# Altium schematic sheet PowerAmplifier.SchDoc
size A4; SheetNumber: 5; SheetTotal: 5
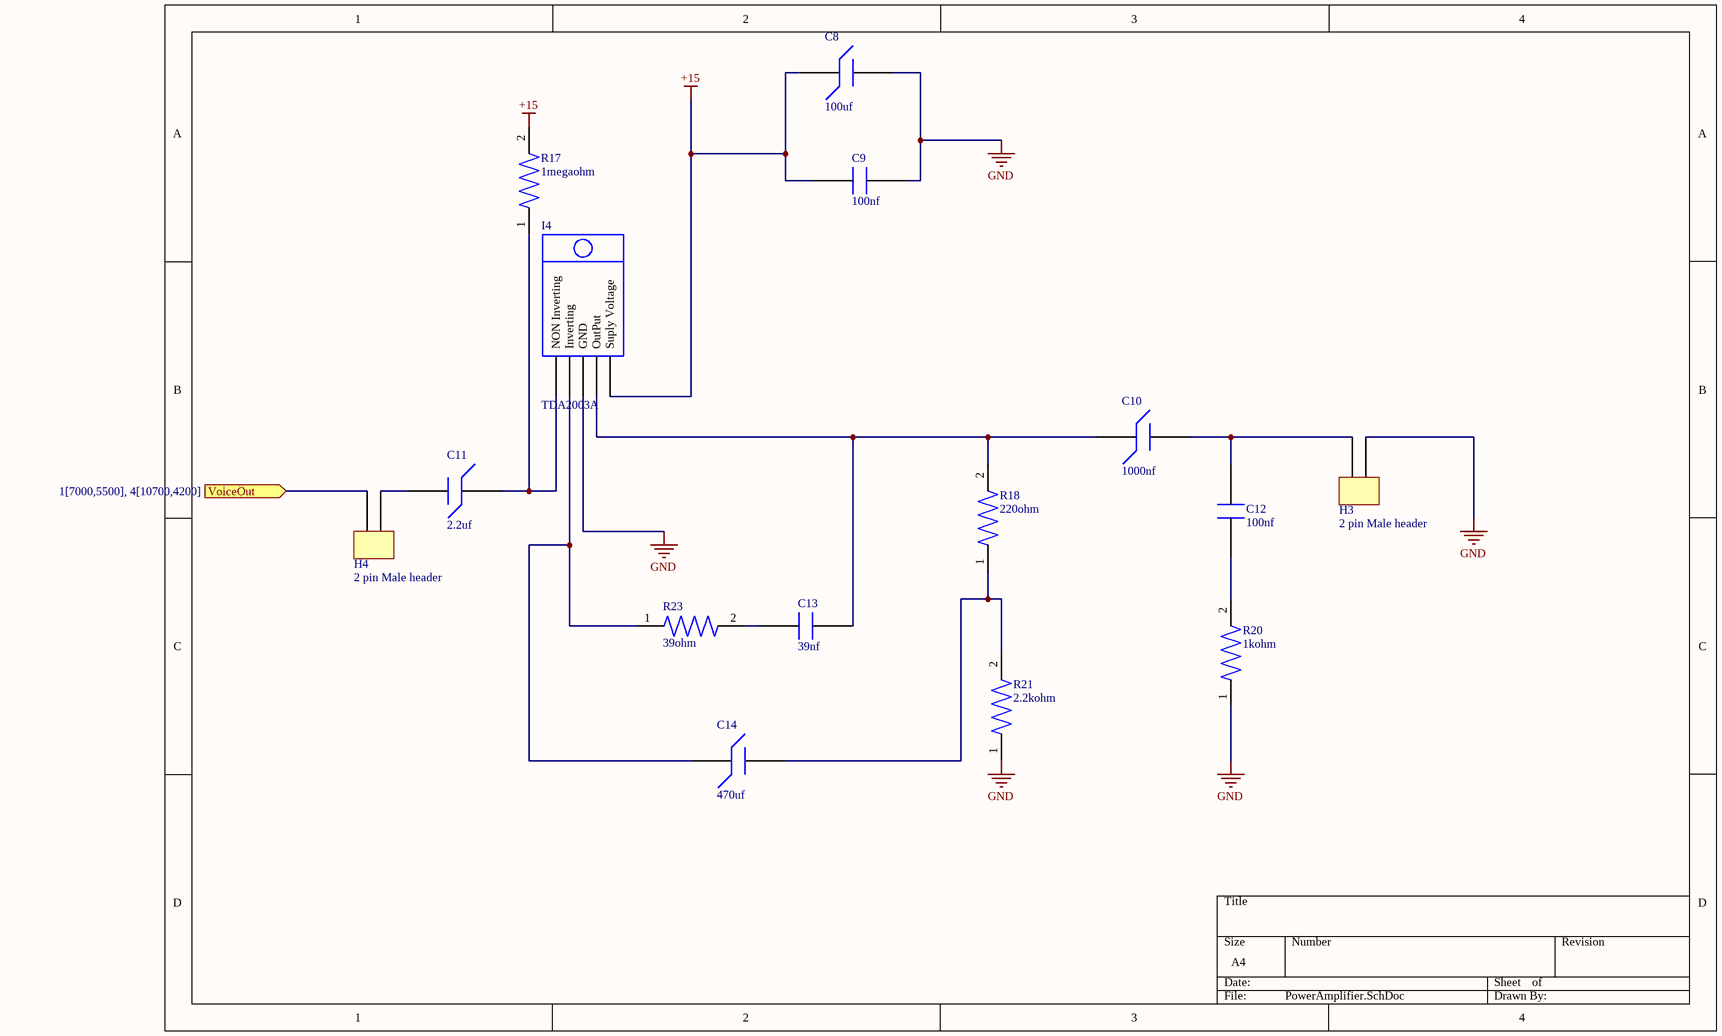
[diagram p0: PowerAmplifier.SchDoc]

## Parts
C8  100uf  [Capasitor]
C9  100nf  [ceramic Capacitor]
C10  1000nf  [Capasitor]
C11  2.2uf  [Capasitor]
C12  100nf  [ceramic Capacitor]
C13  39nf  [Ceramic Capacitor 2]
C14  470uf  [Capasitor]
H3  2 pin Male header  [2pin Male Heder]
H4  2 pin Male header  [2pin Male Heder]
I4  TDA2003A  [TDA2003AV]
R17  1megaohm  [Resistor]
R18  220ohm  [Resistor]
R20  1kohm  [Resistor]
R21  2.2kohm  [Resistor]
R23  39ohm  [Resistor]

## Ports
VoiceOut (in, see 1[7000,5500], 4[10700,4200])

## Nets
+15: C8.2 C9.1 I4.5(Suply_Voltage) R17.2
GND: C8.1 C9.2 H3.1 I4.3(GND) R20.1 R21.1
VoiceOut: H4.2 ; port VoiceOut
NetC10_1: C10.1 C12.2 H3.2
NetC10_2: C10.2 C13.2 I4.4(OutPut) R18.2
NetC11_1: C11.1 H4.1
NetC11_2: C11.2 I4.1(NON_Inverting) R17.1
NetC12_1: C12.1 R20.2
NetC13_1: C13.1 R23.2
NetC14_1: C14.1 R18.1 R21.2
NetC14_2: C14.2 I4.2(Inverting) R23.1

## Library data of the parts
C8 = 35ZLH100MEFC6.3X11: Aluminum Electrolytic Capacitor, Polarized, Aluminum (wet), 35V, 20% +Tol, 20% -Tol, 100uF, Through Hole Mount; Manufacturer: Rubycon; Manufacturer Series: ZLH; Dielectric Material: Aluminium; Ripple Current: 540mA; Supplier: Digikey; Supplier Part Number: 1189-1300-ND; Manufacturer Part Number: 35ZLH100MEFC6.3X11; RoHS: Yes; Category: Aluminum Electrolytic Capacitors; Stock: 13897; Pricing: 1=0.31, 10=0.187, 50=0.1362, 100=0.1201, 500=0.09204, 2000=0.07579, 4000=0.06965, 6000=0.06655 (USD); Pins: 2; Min Operating Temperature: -40°C; Max Operating Temperature: 105°C; Polarity: Polarized; Value: 100uF; Capacitor Type: Aluminium; Tolerance  (fill in as +-): 20%; Package Style: RadialMeter; Packaging: Bulk; Tolerance (fill in as +-): 20%; Rated DC Voltage (URdc): 35V; Diameter: 6.3mm; Length: 11mm; Terminal Pitch: 2.5mm; Reach SVHC Compliant: Yes; RoHS Compliant: Yes; ComponentLink1URL: https://datasheet.ciiva.com:443/pdfs/VipMasterIC/IC/RUBY/RUBYS01453/RUBYS01453-1.pdf?src-supplier=IHS+Markit; ComponentLink1Description: https://datasheet.ciiva.com:443/pdfs/VipMasterIC/IC/RUBY/RUBYS01453/RUBYS01453-1.pdf?src-supplier=IHS+Markit; ComponentLink2URL: https://datasheet.ciiva.com/11782/0900766b80e2f602-11782304.pdf?src-supplier=Rs; ComponentLink2Description: https://datasheet.ciiva.com/11782/0900766b80e2f602-11782304.pdf?src-supplier=Rs; ComponentLink3URL: https://datasheet.ciiva.com/11690/e-zlh-11690956.pdf?src-supplier=Avnet; ComponentLink3Description: https://datasheet.ciiva.com/11690/e-zlh-11690956.pdf?src-supplier=Avnet; ComponentLink4URL: https://datasheet.ciiva.com/1456/e-zlh-1456215.pdf?src-supplier=Element14; ComponentLink4Description: https://datasheet.ciiva.com/1456/e-zlh-1456215.pdf?src-supplier=Element14; ComponentLink5URL: https://datasheet.ciiva.com/5713/e-zlh-5713612.pdf?src-supplier=Farnell; ComponentLink5Description: https://datasheet.ciiva.com/5713/e-zlh-5713612.pdf?src-supplier=Farnell; ComponentLink6URL: https://datasheet.ciiva.com/6311/e-zlh-6311224.pdf?src-supplier=Digikey; ComponentLink6Description: https://datasheet.ciiva.com/6311/e-zlh-6311224.pdf?src-supplier=Digikey
C9 C12 = K104K20X7RK53H5G: Manufacturer: Vishay BCcomponents; Supplier: Digikey; Supplier Part Number: 56-K104K20X7RK53H5G-ND; Manufacturer Part Number: K104K20X7RK53H5G; RoHS: No; Category: Ceramic Capacitors; Stock: 17432; Pricing: 1=0.87, 10=0.559, 100=0.4058, 1000=0.31705, 3000=0.29613 (USD)
C10 = 10ZLH1000MEFC10X12.5: Aluminum Electrolytic Capacitor, Polarized, Aluminum (wet), 10V, 20% +Tol, 20% -Tol, 1000uF, Through Hole Mount; Manufacturer: Rubycon; Dielectric Material: Aluminium; Value: 1mF; Ripple Current: 1.33A; Supplier: Digikey; Supplier Part Number: 1189-1072-ND; Manufacturer Part Number: 10ZLH1000MEFC10X12.5; RoHS: Yes; Category: Aluminum Electrolytic Capacitors; Stock: 171118; Pricing: 1=0.51, 10=0.318, 50=0.2356, 100=0.2095, 500=0.16416, 1000=0.14984, 3000=0.13193, 5000=0.12524 (USD); Pins: 2; Min Operating Temperature: -40°C; Max Operating Temperature: 105°C; Polarity: Polarized; Capacitor Type: Aluminium; Tolerance  (fill in as +-): 20%; Package Style: RadialMeter; Packaging: Bulk; Tolerance (fill in as +-): 20%; Rated DC Voltage (URdc): 10V; Diameter: 10mm; Length: 12.5mm; Terminal Pitch: 5mm; Reach SVHC Compliant: Yes; RoHS Compliant: Yes; ComponentLink1URL: https://datasheet.ciiva.com:443/pdfs/VipMasterIC/IC/RUBY/RUBYS01453/RUBYS01453-1.pdf?src-supplier=IHS+Markit; ComponentLink1Description: https://datasheet.ciiva.com:443/pdfs/VipMasterIC/IC/RUBY/RUBYS01453/RUBYS01453-1.pdf?src-supplier=IHS+Markit; ComponentLink2URL: https://datasheet.ciiva.com/11779/0900766b80e2f602-11779591.pdf?src-supplier=Rs; ComponentLink2Description: https://datasheet.ciiva.com/11779/0900766b80e2f602-11779591.pdf?src-supplier=Rs; ComponentLink3URL: https://datasheet.ciiva.com/6316/e-zlh-6316685.pdf?src-supplier=Digikey; ComponentLink3Description: https://datasheet.ciiva.com/6316/e-zlh-6316685.pdf?src-supplier=Digikey; ComponentLink4URL: https://datasheet.ciiva.com/11690/e-zlh-11690747.pdf?src-supplier=Avnet; ComponentLink4Description: https://datasheet.ciiva.com/11690/e-zlh-11690747.pdf?src-supplier=Avnet; ComponentLink5URL: https://datasheet.ciiva.com/22732/1910927-22732378.pdf?src-supplier=Element14; ComponentLink5Description: https://datasheet.ciiva.com/22732/1910927-22732378.pdf?src-supplier=Element14
C11 = 400LLE2R2MEFC8X11.5: Aluminum Electrolytic Capacitor, Polarized, Aluminum (wet), 400V, 20% +Tol, 20% -Tol, 2.2uF, Through Hole Mount; Manufacturer: Rubycon; Supplier: Digikey; Supplier Part Number: 1189-1329-ND; Manufacturer Part Number: 400LLE2R2MEFC8X11.5; RoHS: Yes; Category: Aluminum Electrolytic Capacitors; Stock: 36469; Pricing: 1=0.53, 10=0.326, 50=0.2416, 100=0.2148, 500=0.16848, 2000=0.14171, 4000=0.1316, 6000=0.1265 (USD); ComponentLink1URL: https://datasheet.ciiva.com:443/pdfs/VipMasterIC/IC/RUBY/RUBYS01654/RUBYS01654-1.pdf?src-supplier=IHS+Markit; ComponentLink1Description: https://datasheet.ciiva.com:443/pdfs/VipMasterIC/IC/RUBY/RUBYS01654/RUBYS01654-1.pdf?src-supplier=IHS+Markit; ComponentLink2URL: https://datasheet.ciiva.com/29544/e-lle-29544381.pdf?src-supplier=Digikey; ComponentLink2Description: https://datasheet.ciiva.com/29544/e-lle-29544381.pdf?src-supplier=Digikey
C13 = C320C393K3G5TA: Manufacturer: KEMET; Supplier: Digikey; Supplier Part Number: C320C393K3G5TA-ND; Manufacturer Part Number: C320C393K3G5TA; RoHS: No; Category: Ceramic Capacitors; Pricing: 1500=0.15707 (USD)
C14 = 16ZLJ470MTA8X11.5: Aluminum Electrolytic Capacitor, Polarized, Aluminum (wet), 16V, 20% +Tol, 20% -Tol, 470uF; Manufacturer: Rubycon; Dielectric Material: Aluminium; Ripple Current: 1.2A; Supplier: Digikey; Supplier Part Number: 1189-1549-1-ND; Manufacturer Part Number: 16ZLJ470MTA8X11.5; RoHS: Yes; Category: Aluminum Electrolytic Capacitors; Stock: 34781; Pricing: 1=0.49, 10=0.305, 50=0.2254, 100=0.2001, 500=0.15654 (USD); Pins: 2; Min Operating Temperature: -40°C; Max Operating Temperature: 105°C; Polarity: Polarized; Value: 470uF; Capacitor Type: Aluminium; Tolerance  (fill in as +-): 20%; Package Style: RadialMeter; Packaging: Tape and Reel; Tolerance (fill in as +-): 20%; Rated DC Voltage (URdc): 16V; Diameter: 8mm; Length: 11.5mm; Terminal Pitch: 5mm; Reach SVHC Compliant: Yes; RoHS Compliant: Yes; ComponentLink1URL: https://datasheet.ciiva.com:443/pdfs/VipMasterIC/IC/RUBY/RUBYS01454/RUBYS01454-1.pdf?src-supplier=IHS+Markit; ComponentLink1Description: https://datasheet.ciiva.com:443/pdfs/VipMasterIC/IC/RUBY/RUBYS01454/RUBYS01454-1.pdf?src-supplier=IHS+Markit; ComponentLink2URL: https://datasheet.ciiva.com/22732/1725816-22732487.pdf?src-supplier=Element14; ComponentLink2Description: https://datasheet.ciiva.com/22732/1725816-22732487.pdf?src-supplier=Element14; ComponentLink3URL: https://datasheet.ciiva.com/6300/e-zlj-6300999.pdf?src-supplier=Digikey; ComponentLink3Description: https://datasheet.ciiva.com/6300/e-zlj-6300999.pdf?src-supplier=Digikey; ComponentLink4URL: https://datasheet.ciiva.com/6301/e-zlj-6301065.pdf?src-supplier=Digikey; ComponentLink4Description: https://datasheet.ciiva.com/6301/e-zlj-6301065.pdf?src-supplier=Digikey
H3 H4 = 61300211121: Board Connector, 2 Contact(s), 1 Row(s), Male, Straight, 0.1 inch Pitch, Solder Terminal, Locking, Black Insulator, Plug; Manufacturer: Wurth Electronics; Option: General Purpose; Contact Pattern: RECTANGULAR; Contact Resistance: 20mR; Contact Style: SQ PIN-SKT; Dielectric Withstanding Voltage (AC): 500V; Filter Feature: No; Insulation Resistance: 1GR; Number Of Connectors: 1; Rated Current (Signal): 3A; Number of Contacts: 2; Body Length: 0.2inch; Reference Standard: UL; Reliability: COMMERCIAL; Supplier: Digikey; Supplier Part Number: 732-5315-ND; Manufacturer Part Number: 61300211121; RoHS: Yes; Category: Headers and Wire Housings; Stock: 123899; Pricing: 1=0.12, 10=0.102, 25=0.0848, 50=0.0712, 100=0.0639, 1000=0.06 (USD); Mounting Technology: Board; Contact Material: Copper Alloy; Contact Finish - Mating: GOLD; Contact Finish - Termination: Gold (Au) - with Nickel (Ni) barrier; Insulation Color: Black; Insulation Material: Polybutylene; Min Operating Temperature: -40°C; Max Operating Temperature: 125°C; Connector Type: BOARD CONNECTOR; JESD-609 Code: e4; Body/Shell Style: PLUG; Contact Gender: Male; Mixed Contacts: No; Mounting Style: STRAIGHT; Number of Rows Loaded: 1; PCB Contact Pattern: RECTANGULAR; Termination: Solder; Body Breadth: 0.1inch; Body Depth: 0.1inch; Mating Contact Pitch: 0.1inch; Mounting Option 1: LOCKING; Terminal Length: 0.118inch; Terminal Pitch: 2.54mm; Flammability Rating: UL94 V-0; Reach SVHC Compliant: Yes; RoHS Compliant: Yes; DIN Conformance: No; IEC Conformance: No; MIL Conformance: No; ComponentLink1URL: https://datasheet.ciiva.com:443/pdfs/VipMasterIC/IC/MIDC/MIDCS07676/MIDCS07676-1.pdf?src-supplier=IHS+Markit; ComponentLink1Description: https://datasheet.ciiva.com:443/pdfs/VipMasterIC/IC/MIDC/MIDCS07676/MIDCS07676-1.pdf?src-supplier=IHS+Markit; ComponentLink2URL: https://datasheet.ciiva.com/13619/6130xx11121-48870-13619345.pdf?src-supplier=Mouser; ComponentLink2Description: https://datasheet.ciiva.com/13619/6130xx11121-48870-13619345.pdf?src-supplier=Mouser
I4 = TDA2003AV: Audio Amplifier, 12W, 1 Channel(s), 1 Func, Bipolar; Manufacturer: STMicroelectronics; Bandwidth-Nom: 15MHz; Gain: 40dB; Number of Channels: 1; Power Supplies: 14.4V; Surface Mount: No; Qualification Status: Not Qualified; Supplier: Farnell; Supplier Part Number: 2067880; Manufacturer Part Number: TDA2003AV; RoHS: Yes; Category: Amplifiers - Audio; Pricing: 1=0.94, 10=0.83, 100=0.65, 250=0.57, 500=0.5 (GBP); Case/Package: ZIP; Pins: 5; Package Shape: Rectangular; Terminal Finish: Tin; JESD-609 Code: e3; Consumer IC Type: AUDIO AMPLIFIER; Channels: 1; Output Power-Nom: 12W; Technology: BIPOLAR; Terminal Form: Through Hole; Terminal Position: ZIG-ZAG; Terminal Pitch: 1.7mm; RoHS Compliant: Yes; Reach SVHC Compliant: No; ComponentLink1URL: https://datasheet.ciiva.com:443/pdfs/VipMasterIC/IC/SGST/SGSTS34642/SGSTS34847-1.pdf?src-supplier=IHS+Markit; ComponentLink1Description: https://datasheet.ciiva.com:443/pdfs/VipMasterIC/IC/SGST/SGSTS34642/SGSTS34847-1.pdf?src-supplier=IHS+Markit; ComponentLink2URL: https://datasheet.ciiva.com/4767/dm00028077-100155-4767180.pdf?src-supplier=Mouser; ComponentLink2Description: https://datasheet.ciiva.com/4767/dm00028077-100155-4767180.pdf?src-supplier=Mouser; ComponentLink3URL: https://datasheet.ciiva.com/19463/2183867-19463360.pdf?src-supplier=Jameco; ComponentLink3Description: https://datasheet.ciiva.com/19463/2183867-19463360.pdf?src-supplier=Jameco; ComponentLink4URL: https://datasheet.ciiva.com/15131/getdatasheetpartid-365868-15131921.pdf?src-supplier=Verical; ComponentLink4Description: https://datasheet.ciiva.com/15131/getdatasheetpartid-365868-15131921.pdf?src-supplier=Verical; ComponentLink5URL: https://datasheet.ciiva.com/1481/1690488-1481698.pdf?src-supplier=Element14; ComponentLink5Description: https://datasheet.ciiva.com/1481/1690488-1481698.pdf?src-supplier=Element14; ComponentLink6URL: https://datasheet.ciiva.com/16493/dm00028077-16493721.pdf?src-supplier=Future+Electronics; ComponentLink6Description: https://datasheet.ciiva.com/16493/dm00028077-16493721.pdf?src-supplier=Future+Electronics; ComponentLink7URL: https://datasheet.ciiva.com/1790/dm00028077-1790102.pdf?src-supplier=Digikey; ComponentLink7Description: https://datasheet.ciiva.com/1790/dm00028077-1790102.pdf?src-supplier=Digikey
R17 = CF14JT1M00: Fixed Resistor, Carbon Film, 0.25W, 1000000ohm, 350V, 5% +/-Tol, -1500,0ppm/Cel, Through Hole Mount; Manufacturer: Stackpole Electronics; Power: 250mW; Rated Temperature: 70°C; Value: 1MR; Temperature Coefficient (ppm/Cel): 1500; Lead Diameter: 0.55mm; Lead Length: 28mm; Package Length: 6mm; Supplier: Digikey; Supplier Part Number: CF14JT1M00CT-ND; Manufacturer Part Number: CF14JT1M00; RoHS: Yes; Category: Through-Hole Resistors; Stock: 240510; Pricing: 1=0.1, 10=0.026, 25=0.022, 50=0.0192, 100=0.0169, 250=0.01424, 500=0.0126, 1000=0.0112 (USD); Mounting Technology: Through Hole; Pins: 2; Package Shape: Tubular; Terminal Finish: Tin; Min Operating Temperature: -55°C; Max Operating Temperature: 155°C; Tolerance: 5%; Resistor Type: FIXED RESISTOR; Construction: Tubular; Package Style: AXIAL; Packaging: Tape and Reel; Technology: CARBON FILM; Termination: Wire; Working Voltage: 350V; JESD-609 Code: e3; Reach SVHC Compliant: Yes; RoHS Compliant: Yes; ComponentLink1URL: https://datasheet.ciiva.com:443/pdfs/VipMasterIC/IC/SEIE/SEIE-S-A0009883960/SEIE-S-A0009883960-1.pdf?src-supplier=IHS+Markit; ComponentLink1Description: https://datasheet.ciiva.com:443/pdfs/VipMasterIC/IC/SEIE/SEIE-S-A0009883960/SEIE-S-A0009883960-1.pdf?src-supplier=IHS+Markit; ComponentLink2URL: https://datasheet.ciiva.com/15193/getdatasheetpartid-359898-15193308.pdf?src-supplier=Verical; ComponentLink2Description: https://datasheet.ciiva.com/15193/getdatasheetpartid-359898-15193308.pdf?src-supplier=Verical
R18 = S4-220RF1: RES SMD 220 OHM 1% 2W 4525; Manufacturer: Riedon; Supplier: Digikey; Supplier Part Number: 696-S4-220RF1CT-ND; Manufacturer Part Number: S4-220RF1; RoHS: Yes; Category: Chip SMD Resistors; Stock: 180; Pricing: 1=2.38, 10=1.582, 25=1.3652, 50=1.23, 100=1.1147, 250=0.98852, 500=0.90956 (USD); ComponentLink1URL: https://datasheet.ciiva.com/18599/ssl-18599814.pdf?src-supplier=Digikey; ComponentLink1Description: https://datasheet.ciiva.com/18599/ssl-18599814.pdf?src-supplier=Digikey; ComponentLink2URL: https://datasheet.ciiva.com/18599/ssl-18599815.pdf?src-supplier=Digikey; ComponentLink2Description: https://datasheet.ciiva.com/18599/ssl-18599815.pdf?src-supplier=Digikey; ComponentLink3URL: https://datasheet.ciiva.com/18599/ssl-18599816.pdf?src-supplier=Digikey; ComponentLink3Description: https://datasheet.ciiva.com/18599/ssl-18599816.pdf?src-supplier=Digikey
R20 = CF14JT1K00: Fixed Resistor, Carbon Film, 0.25W, 1000ohm, 350V, 5% +/-Tol, -400,0ppm/Cel, Through Hole Mount; Manufacturer: Stackpole Electronics; Power: 250mW; Rated Temperature: 70°C; Value: 1kR; Temperature Coefficient (ppm/Cel): 400; Lead Diameter: 0.55mm; Lead Length: 28mm; Package Length: 6mm; Supplier: Digikey; Supplier Part Number: CF14JT1K00CT-ND; Manufacturer Part Number: CF14JT1K00; RoHS: Yes; Category: Through-Hole Resistors; Stock: 680385; Pricing: 1=0.1, 10=0.026, 25=0.022, 50=0.0192, 100=0.0169, 250=0.01424, 500=0.0126, 1000=0.0112 (USD); Mounting Technology: Through Hole; Pins: 2; Package Shape: Tubular; Terminal Finish: Tin; Min Operating Temperature: -55°C; Max Operating Temperature: 155°C; Tolerance: 5%; Resistor Type: FIXED RESISTOR; Construction: Tubular; Package Style: AXIAL; Packaging: Tape and Reel; Technology: CARBON FILM; Termination: Wire; Working Voltage: 350V; JESD-609 Code: e3; Reach SVHC Compliant: Yes; RoHS Compliant: Yes; ComponentLink1URL: https://datasheet.ciiva.com:443/pdfs/VipMasterIC/IC/SEIE/SEIE-S-A0009883960/SEIE-S-A0009883960-1.pdf?src-supplier=IHS+Markit; ComponentLink1Description: https://datasheet.ciiva.com:443/pdfs/VipMasterIC/IC/SEIE/SEIE-S-A0009883960/SEIE-S-A0009883960-1.pdf?src-supplier=IHS+Markit; ComponentLink2URL: https://www.seielect.com/catalog/SEI-Packaging.pdf?src-supplier=Digikey; ComponentLink2Description: https://www.seielect.com/catalog/SEI-Packaging.pdf?src-supplier=Digikey; ComponentLink3URL: https://www.seielect.com/Catalog/SEI-CF_CFM.pdf?src-supplier=Digikey; ComponentLink3Description: https://www.seielect.com/Catalog/SEI-CF_CFM.pdf?src-supplier=Digikey; ComponentLink4URL: https://www.seielect.com/catalog/SEI-CF_CFM.pdf?src-supplier=Avnet; ComponentLink4Description: https://www.seielect.com/catalog/SEI-CF_CFM.pdf?src-supplier=Avnet; ComponentLink5URL: http://components.arrow.com/part/dataview/27620077S9848643N1174?src-supplier=Arrow+Electronics; ComponentLink5Description: http://components.arrow.com/part/dataview/27620077S9848643N1174?src-supplier=Arrow+Electronics; ComponentLink6URL: http://www.seielect.com/Catalog/SEI-CF_CFM.pdf?src-supplier=Future+Electronics; ComponentLink6Description: http://www.seielect.com/Catalog/SEI-CF_CFM.pdf?src-supplier=Future+Electronics; ComponentLink7URL: https://datasheet.octopart.com/CF14JT1K00-Stackpole-Electronics-datasheet-8360004.pdf?src-supplier=Future+Electronics; ComponentLink7Description: https://datasheet.octopart.com/CF14JT1K00-Stackpole-Electronics-datasheet-8360004.pdf?src-supplier=Future+Electronics; ComponentLink8URL: https://www.verical.com/server-webapp/html/getDatasheet?partID=360403&src-supplier=Verical; ComponentLink8Description: https://www.verical.com/server-webapp/html/getDatasheet?partID=360403&src-supplier=Verical; ComponentLink9URL: https://datasheet.octopart.com/CF14JT1K00-Stackpole-Electronics-datasheet-32780772.pdf?src-supplier=Master+Electronics; ComponentLink9Description: https://datasheet.octopart.com/CF14JT1K00-Stackpole-Electronics-datasheet-32780772.pdf?src-supplier=Master+Electronics
R21 = OY222KE: Fixed Resistor, Ceramic Composition, 2W, 2200ohm, 400V, 10% +/-Tol, 1600ppm/Cel, Through Hole Mount; Manufacturer: Ohmite; Rated Temperature: 70°C; Value: 2.2kR; Temperature Coefficient (ppm/Cel): 1600; Lead Diameter: 0.8mm; Lead Length: 38mm; Package Length: 19mm; Supplier: Digikey; Supplier Part Number: OY222KE-ND; Manufacturer Part Number: OY222KE; RoHS: Yes; Category: Through-Hole Resistors; Stock: 1622; Pricing: 1=3.52, 10=2.365, 25=2.0516, 50=1.8554, 100=1.6884, 250=1.50564, 500=1.39132, 1000=1.29418, 5000=1.12139 (USD); Mounting Technology: Through Hole; Pins: 2; Package Shape: Tubular; Terminal Finish: Copper; Min Operating Temperature: -40°C; Max Operating Temperature: 220°C; Tolerance: 10%; JESD-609 Code: e2; Resistor Type: FIXED RESISTOR; Construction: Cylindrical; Package Style: AXIAL; Packaging: Tape and Reel; Power: 2W; Series: OY; Technology: CERAMIC COMPOSITION; Termination: Wire; Working Voltage: 400V; Reach SVHC Compliant: Yes; RoHS Compliant: Yes; ComponentLink1URL: https://datasheet.ciiva.com:443/pdfs/VipMasterIC/IC/OMIT/OMITS00880/OMITS00880-1.pdf?src-supplier=IHS+Markit; ComponentLink1Description: https://datasheet.ciiva.com:443/pdfs/VipMasterIC/IC/OMIT/OMITS00880/OMITS00880-1.pdf?src-supplier=IHS+Markit; ComponentLink2URL: https://datasheet.ciiva.com/2716/res-ox-oy-2716360.pdf?src-supplier=Digikey; ComponentLink2Description: https://datasheet.ciiva.com/2716/res-ox-oy-2716360.pdf?src-supplier=Digikey; ComponentLink3URL: https://datasheet.ciiva.com/16723/70022171-16723470.pdf?src-supplier=Allied+Electronics; ComponentLink3Description: https://datasheet.ciiva.com/16723/70022171-16723470.pdf?src-supplier=Allied+Electronics; ComponentLink4URL: https://datasheet.ciiva.com/15784/ox-oy-series-15784138.pdf?src-supplier=Onlinecomponents.com; ComponentLink4Description: https://datasheet.ciiva.com/15784/ox-oy-series-15784138.pdf?src-supplier=Onlinecomponents.com; ComponentLink5URL: https://datasheet.ciiva.com/15199/getdatasheetpartid-693640-15199061.pdf?src-supplier=Verical; ComponentLink5Description: https://datasheet.ciiva.com/15199/getdatasheetpartid-693640-15199061.pdf?src-supplier=Verical; ComponentLink6URL: https://datasheet.ciiva.com/7715/95960-7715879.pdf?src-supplier=Element14; ComponentLink6Description: https://datasheet.ciiva.com/7715/95960-7715879.pdf?src-supplier=Element14
R23 = ROX1SJ39R: Fixed Resistor, Metal Oxide Film, 1W, 39ohm, 350V, 5% +/-Tol, 350ppm/Cel, Through Hole Mount; Manufacturer: TE Connectivity; Manufacturer Series: ROX; Rated Temperature: 70°C; Value: 39R; Temperature Coefficient (ppm/Cel): 300; Lead Diameter: 0.54mm; Package Length: 10mm; Supplier: Digikey; Supplier Part Number: A131465CT-ND; Manufacturer Part Number: ROX1SJ39R; RoHS: Yes; Category: Through-Hole Resistors; Stock: 162196; Pricing: 1=0.1, 10=0.075, 50=0.066, 100=0.0622, 500=0.05628 (USD); Mounting Technology: Through Hole; Pins: 2; Package Shape: Tubular; Min Operating Temperature: -55°C; Max Operating Temperature: 235°C; Tolerance: 5%; Resistor Type: FIXED RESISTOR; Construction: Flameproof; Package Style: AXIAL; Packaging: Ammo Pack; Power: 1W; Series: ROX; Technology: METAL OXIDE FILM; Termination: Wire; Working Voltage: 350V; Reach SVHC Compliant: Yes; RoHS Compliant: Yes; ComponentLink1URL: https://datasheet.ciiva.com:443/pdfs/VipMasterIC/IC/TYEL/TYEL-S-A0009531935/TYEL-S-A0009530835-1.pdf?src-supplier=IHS+Markit; ComponentLink1Description: https://datasheet.ciiva.com:443/pdfs/VipMasterIC/IC/TYEL/TYEL-S-A0009531935/TYEL-S-A0009530835-1.pdf?src-supplier=IHS+Markit; ComponentLink2URL: https://datasheet.ciiva.com/11823/0900766b800275a1-11823946.pdf?src-supplier=Rs; ComponentLink2Description: https://datasheet.ciiva.com/11823/0900766b800275a1-11823946.pdf?src-supplier=Rs; ComponentLink3URL: https://datasheet.ciiva.com/2726/eng-ds-1773271-e-2726594.pdf?src-supplier=Digikey; ComponentLink3Description: https://datasheet.ciiva.com/2726/eng-ds-1773271-e-2726594.pdf?src-supplier=Digikey; ComponentLink4URL: https://datasheet.ciiva.com/16756/70063511-16756136.pdf?src-supplier=Allied+Electronics; ComponentLink4Description: https://datasheet.ciiva.com/16756/70063511-16756136.pdf?src-supplier=Allied+Electronics